# EAGLE design AnyFridge (EAGLE 9.6.2)
REV: 1.0
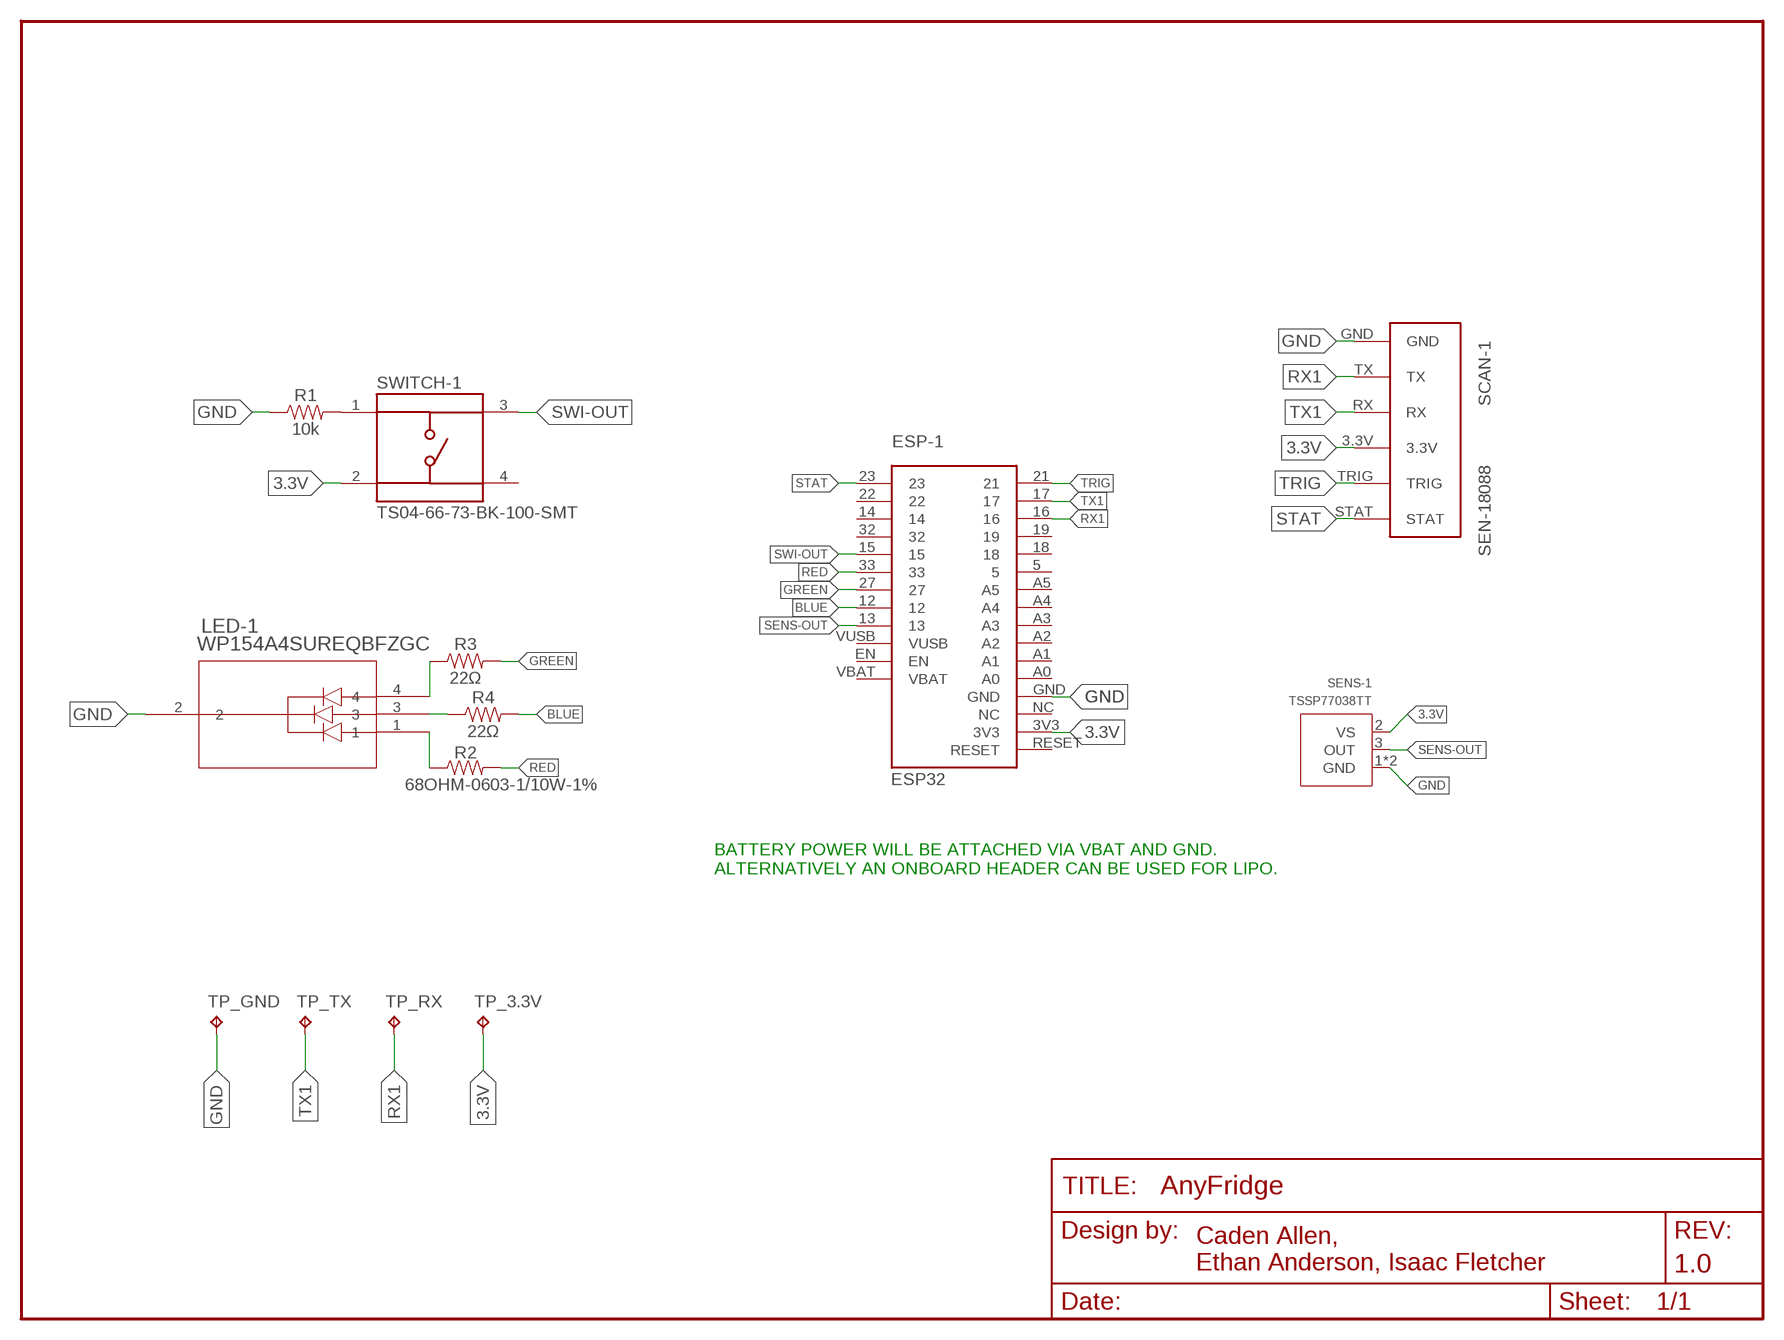
[diagram p0: schematic, sheet 1]

## Parts
ESP-1  ESP32  [ESP32]
FRAME1  FRAME-LETTERNO_PACKAGE  [DUMMY]
LED-1  WP154A4SUREQBFZGC  [LED4_WP154A4SUREQBFZGC_KNB]
R1  10k  10KOHM-HORIZ-1/4W-1%  [AXIAL-0.3]
R2  68OHM-0603-1/10W-1%  [0603]
R3  22Ω  22OHM-0603-1/10W-1%  [0603]
R4  22Ω  22OHM-0603-1/10W-1%  [0603]
SCAN-1  SEN-18088  [SEN-18088]
SENS-1  TSSP77038TT  [TSSP77038TT]
SWITCH-1  TS04-66-73-BK-100-SMT  [SW_TS04-66-73-BK-100-SMT]
TP_3.3V  TPPAD1-13  [P1-13]
TP_GND  TPPAD1-13  [P1-13]
TP_RX  TPPAD1-13  [P1-13]
TP_TX  TPPAD1-13  [P1-13]

## Nets
3.3V: ESP-1.3V3 SCAN-1.3.3V SENS-1.2(VS) SWITCH-1.2 TP_3.3V.TP
BLUE: ESP-1.12 R4.2
BLUE-IN: LED-1.3 R4.1
GND: ESP-1.GND LED-1.2 R1.P$1 SCAN-1.GND SENS-1.1(GND) SENS-1.4(GND) TP_GND.TP
GREEN: ESP-1.27 R3.2
GREEN-IN: LED-1.4 R3.1
N$1: R1.P$2 SWITCH-1.1
RED: ESP-1.33 R2.2
RED-IN: LED-1.1 R2.1
RX1: ESP-1.16 SCAN-1.TX TP_RX.TP
SENS-OUT: ESP-1.13 SENS-1.3(OUT)
STAT: ESP-1.23 SCAN-1.STAT
SWI-OUT: ESP-1.15 SWITCH-1.3
TRIG: ESP-1.21 SCAN-1.TRIG
TX1: ESP-1.17 SCAN-1.RX TP_TX.TP
Unconnected: ESP-1.5 ESP-1.14 ESP-1.18 ESP-1.19 ESP-1.22 ESP-1.32 ESP-1.A0 ESP-1.A1 ESP-1.A2 ESP-1.A3 ESP-1.A4 ESP-1.A5 ESP-1.EN ESP-1.NC ESP-1.RESET ESP-1.VBAT ESP-1.VUSB SWITCH-1.4

## Notes on the sheet
- BATTERY POWER WILL BE ATTACHED VIA VBAT AND GND.
  ALTERNATIVELY AN ONBOARD HEADER CAN BE USED FOR LIPO.

## Library data of the parts
ESP-1 = ESP32:ESP32: Device for the ESP32 WROOM development board
FRAME1 = Frame:FRAME-LETTER: Schematic Frame - Letter Standard 8.5x11 US Letter frame; DESIGNER: Nobody; VERSION: v01
LED-1 = MISC-PARTS:WP154A4SUREQBFZGC; COPYRIGHT: Copyright (C) 2025 Ultra Librarian. All rights reserved.; MANUFACTURER_PART_NUMBER: WP154A4SUREQBFZGC; MFR_NAME: Kingbright
R1 = SparkFun-Resistors:10KOHM: 10kΩ resistor A resistor is a passive two-terminal electrical component that implements electrical resistance as a circuit element. Resistors act to reduce current flow, and, at the same time, act to lower voltage levels within circuits. - Wikipedia; PROD_ID: RES-12183
R2 = SparkFun-Resistors:68OHM: 68Ω resistor A resistor is a passive two-terminal electrical component that implements electrical resistance as a circuit element. Resistors act to reduce current flow, and, at the same time, act to lower voltage levels within circuits. - Wikipedia
R3 R4 = SparkFun-Resistors:22OHM: 22Ω resistor A resistor is a passive two-terminal electrical component that implements electrical resistance as a circuit element. Resistors act to reduce current flow, and, at the same time, act to lower voltage levels within circuits. - Wikipedia; PROD_ID: RES-08698
SCAN-1 = SEN-18088:SEN-18088
SENS-1 = MISC-PARTS:TSSP77038TT: Check availability <https://pricing.snapeda.com/parts/TSSP77038TT/Vishay/view-part?ref=eda>; AVAILABILITY: In Stock; CHECK_PRICES: https://www.snapeda.com/parts/TSSP77038TT/Vishay/view-part/?ref=eda; DESCRIPTION: Remote Receiver Sensor 38.0kHz 40m Surface Mount; MF: Vishay; MP: TSSP77038TT; PACKAGE: None; PRICE: None; SNAPEDA_LINK: https://www.snapeda.com/parts/TSSP77038TT/Vishay/view-part/?ref=snap
SWITCH-1 = MISC-PARTS:TS04-66-73-BK-100-SMT; MANUFACTURER: CUI Devices; PARTREV: 1.0; STANDARD: Manufacturer Recommendations
TP_3.3V TP_GND TP_RX TP_TX = testpad:TP: Test pad

## Board
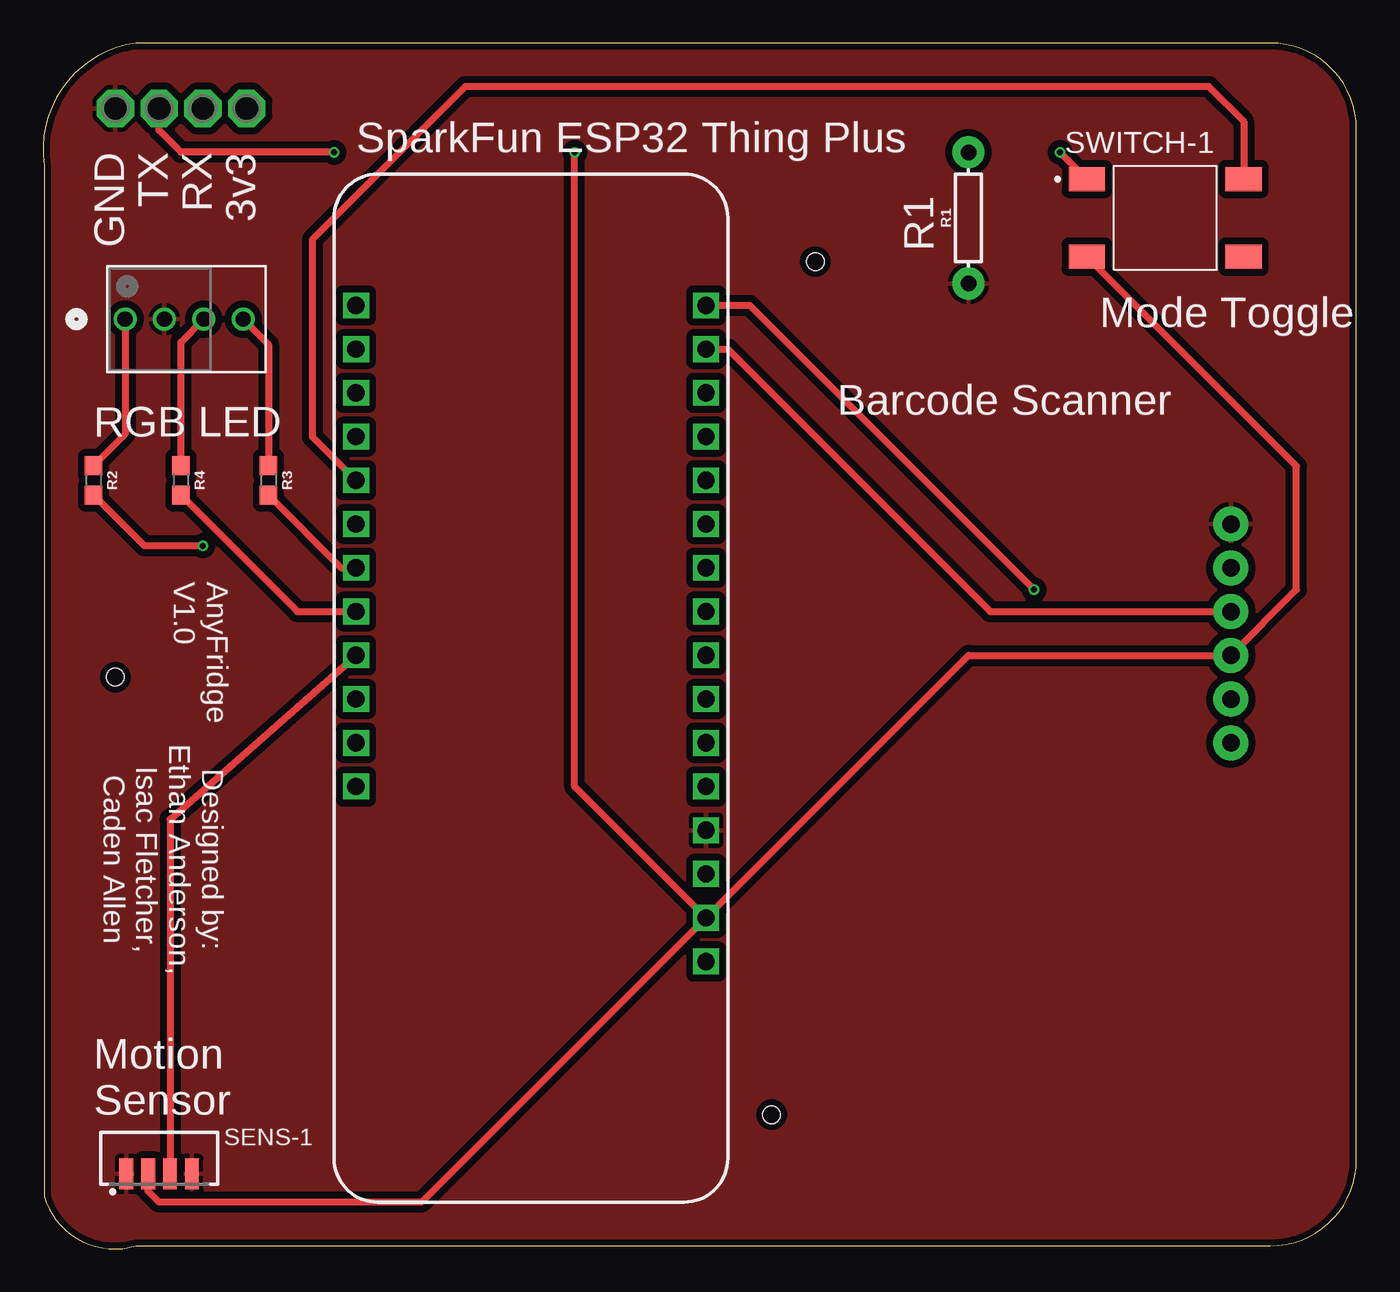
[diagram p1: board, top side]
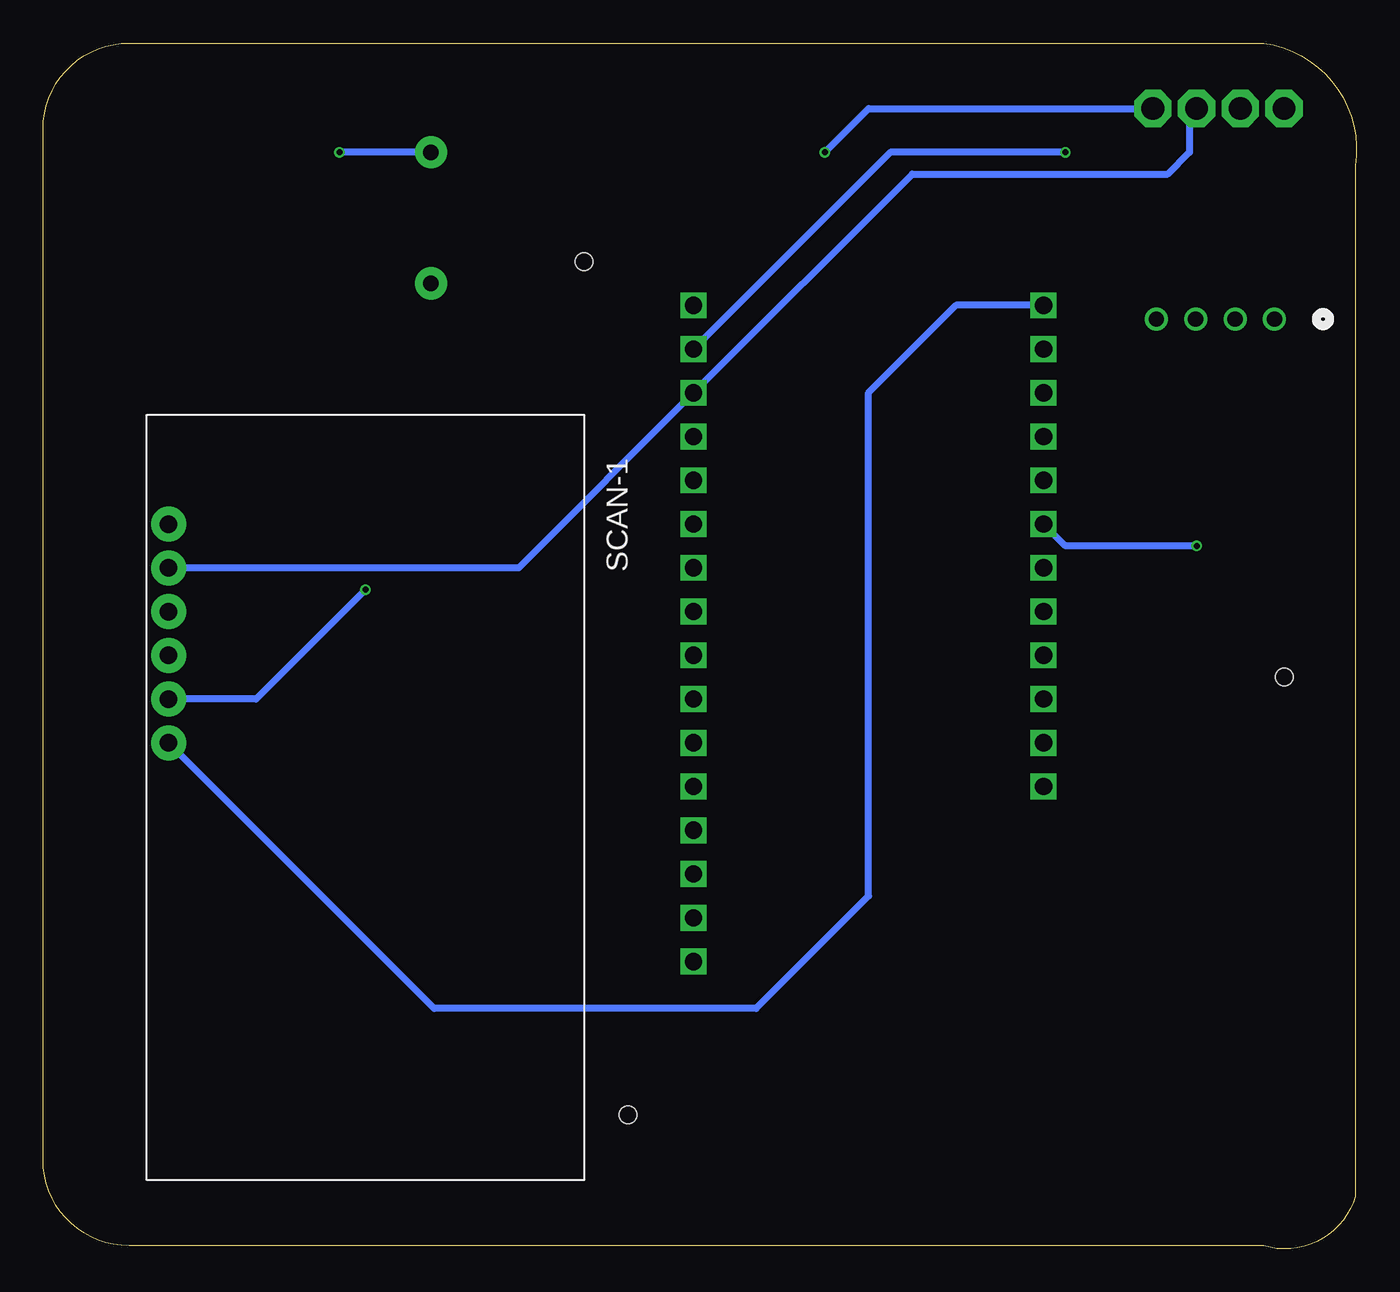
[diagram p2: board, bottom side, seen from below]

Size 76.26 x 70.02 mm. Coordinates in mm from the lower left corner, seen from the top.
Outline: 71.26,70.02 5.39,70.02 arc90 0.06,62.9 0.06,3.06 arc90 5.39,0.18 71.26,0.18 arc90 76.26,5.18 76.26,65.02 arc90 71.26,70.02
Copper layers (1*16): Top 0.035559375mm / dielectric 1.6mm / Bottom 0.035559375mm
Design rules "oshpark-2layer *": minimum track width 6mil, minimum drill 10mil, track to track 16mil, track to pad 6mil, pad to pad 6mil, via to via 6mil, smd to smd 6mil, copper to edge 15mil, drill to drill 6mil, minimum pad ring 5mil, minimum via ring 5mil, stop-mask expansion 2.5mil, vias tented up to drill 0mil, thermal gap 10mil
Holes 1 mm at 42.3,7.8 44.84,57.33 4.2,33.2

### Footprints (pad centres in the part's own frame; a part is rotated, then mirrored left to right if it is on the bottom)
ESP32 = drill 1 pad 1.27 square: 3V3 20.32,16.51; 5 20.32,39.37; 12 0,34.29; 13 0,31.75; 14 0,46.99; 15 0,41.91; 16 20.32,46.99; 17 20.32,49.53; 18 20.32,41.91; 19 20.32,44.45; 21 20.32,52.07; 22 0,49.53; 23 0,52.07; 27 0,36.83; 32 0,44.45; 33 0,39.37; A0 20.32,24.13; A1 20.32,26.67; A2 20.32,29.21; A3 20.32,31.75; A4 20.32,34.29; A5 20.32,36.83; EN 0,26.67; GND 20.32,21.59; NC 20.32,19.05; RESET 20.32,13.97; VBAT 0,24.13; VUSB 0,29.21
LED4_WP154A4SUREQBFZGC_KNB = drill 0.889 pad 1.194: 1 -0.127,0; 2 2.159,0; 3 4.445,0; 4 6.731,0
AXIAL-0.3 = drill 0.9 pad 1.88: P$1 -3.81,0; P$2 3.81,0
0603 = smd 1.1 x 1: 1 -0.85,0; 2 0.85,0
SEN-18088 = drill 1.016 pad 2.032: 3.3V 13.97,-24.13; GND 6.35,-24.13; RX 11.43,-24.13; STAT 19.05,-24.13; TRIG 16.51,-24.13; TX 8.89,-24.13
TSSP77038TT = smd 0.8 x 1.8: 1 -1.905,-0.9; 2 -0.635,-0.9; 3 0.635,-0.9; 4 1.905,-0.9
SW_TS04-66-73-BK-100-SMT = smd 2.1 x 1.4: 1 -4.55,2.25; 2 -4.55,-2.25; 3 4.55,2.25; 4 4.55,-2.25
P1-13 = drill 1.321 pad 2.159 octagon: TP 0,0

### Placement (x,y rotation side)
ESP-1  18.17,2.72 0 top
FRAME1  41.03,2.72 0 top
LED-1  4.89,53.99 0 top
R1  53.73,59.87 90 top
R2  2.93,44.63 270 top
R3  13.09,44.63 270 top
R4  8.01,44.63 270 top
SCAN-1  44.84,48.44 270 bottom
SENS-1  6.74,5.26 0 top
SWITCH-1  65.16,59.87 0 top
TP_3.3V  11.82,66.22 90 top
TP_GND  4.2,66.22 90 top
TP_RX  9.28,66.22 90 top
TP_TX  6.74,66.22 90 top

### Tracks (layer width: path | path; a pad name or v marks a point on that pad's centre or on a via)
3.3V  (via drill 0.35)
  Top 0.406: ESP-1.3V3 21.98,2.72 6.74,2.72 6.1,3.35 SENS-1.2 | ESP-1.3V3 30.87,26.85 v30.87,63.68 | SWITCH-1.2 72.78,45.45 72.78,38.28 SCAN-1.3.3V 53.73,34.47 ESP-1.3V3
  Bottom 0.406: TP_3.3V.TP 28.33,66.22 v30.87,63.68
BLUE
  Top 0.406: R4.2 14.78,37.01 ESP-1.12
BLUE-IN
  Top 0.406: R4.1 8.01,52.66 LED-1.3
GND
  pour Top: -3.42,80.19 -3.42,0.18 98.18,0.18 98.18,80.19
GREEN
  Top 0.406: R3.2 17.32,39.55 ESP-1.27
GREEN-IN
  Top 0.406: LED-1.4 13.09,52.52 R3.1
N$1  (via drill 0.35)
  Top 0.406: v59.05,63.68 SWITCH-1.1
  Bottom 0.406: R1.P$2 v59.05,63.68
RED  (via drill 0.35)
  Top 0.406: v9.28,40.82 5.89,40.82 R2.2
  Bottom 0.406: ESP-1.33 16.9,40.82 v9.28,40.82
RED-IN
  Top 0.406: LED-1.1 4.76,47.31 R2.1
RX1
  Bottom 0.406: TP_RX.TP 9.69,65.81 9.69,63.68 10.96,62.41 25.79,62.41 ESP-1.16 48.65,39.55 SCAN-1.TX
SENS-OUT
  Top 0.406: ESP-1.13 7.37,24.94 SENS-1.3
STAT
  Bottom 0.406: ESP-1.23 23.25,54.79 28.33,49.71 28.33,20.5 34.86,13.96 53.54,13.96 SCAN-1.STAT
SWI-OUT
  Top 0.406: ESP-1.15 15.63,47.17 15.63,58.6 24.52,67.49 67.7,67.49 69.71,65.48 SWITCH-1.3
TRIG  (via drill 0.35)
  Top 0.406: v57.54,38.28 41.03,54.79 ESP-1.21
  Bottom 0.406: v57.54,38.28 63.89,31.93 SCAN-1.TRIG
TX1  (via drill 0.35)
  Top 0.406: v16.9,63.68 8.01,63.68 6.74,64.95 TP_TX.TP | ESP-1.17 39.76,52.25 55,37.01 SCAN-1.RX
  Bottom 0.406: v16.9,63.68 27.06,63.68 ESP-1.17

### Text on the board
tPlace: GND | RX | 3v3 | SparkFun ESP32 Thing Plus | R1 | Mode Toggle | Barcode Scanner | RGB LED | AnyFridge / V1.0 | Designed by: / Ethan Anderson, / Isac Fletcher, / Caden Allen | Motion / Sensor
tNames: TX